# Altium schematic sheet ESC.SchDoc
size A
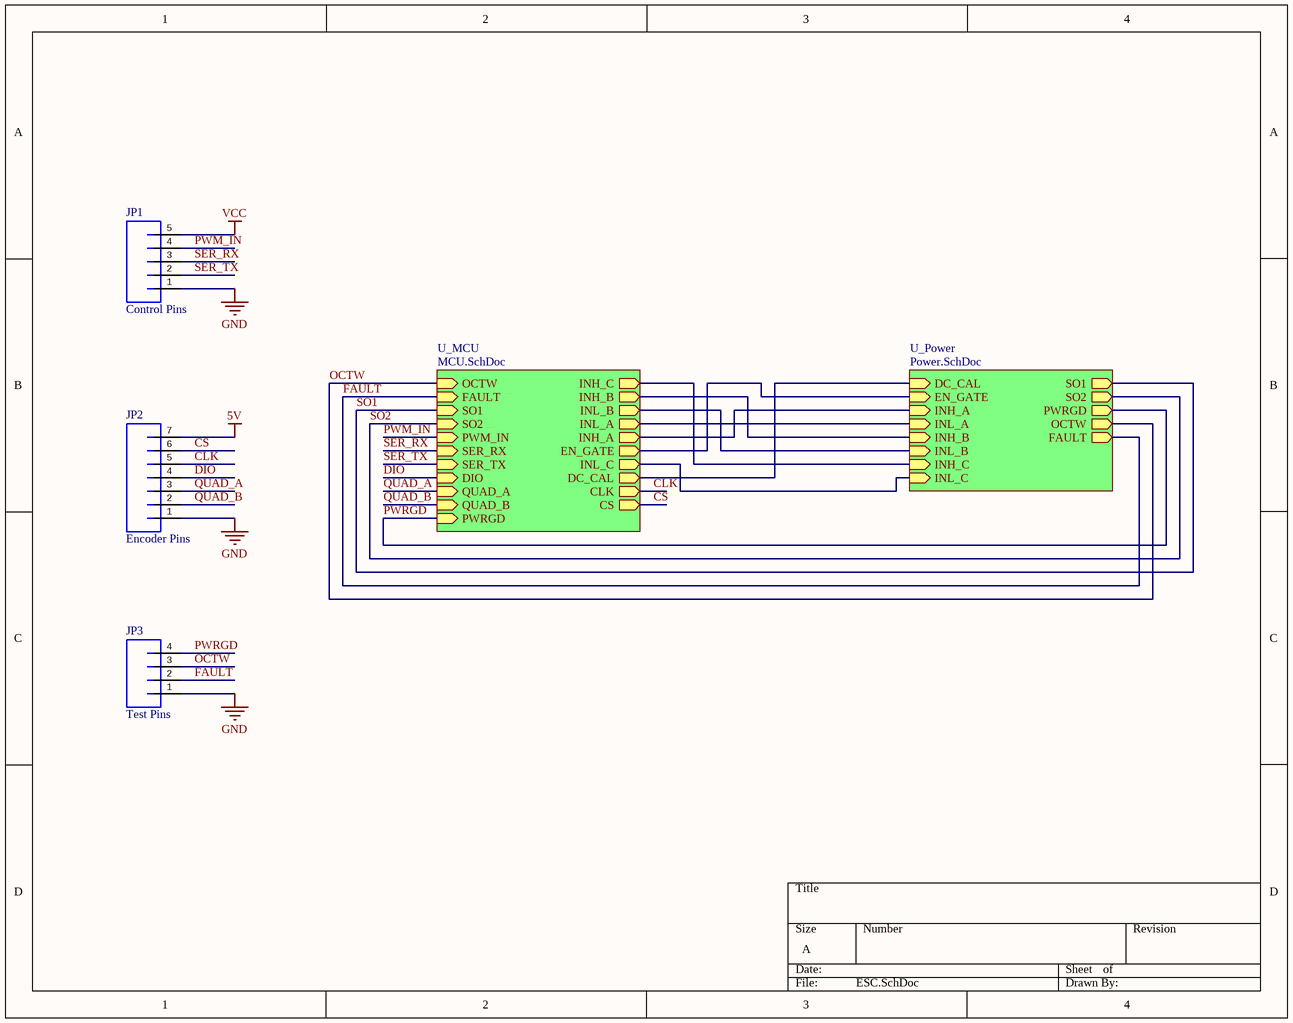
[diagram p0: ESC.SchDoc]

## Parts
JP1  Control Pins  [JST-5-PTH-VERT]
JP2  Encoder Pins  [JST-7-PTH-VERT]
JP3  Test Pins  [JST-4-PTH-VERT]

## Sub-sheets
U_MCU = MCU.SchDoc: INH_C (out), INH_B (out), INL_B (out), OCTW (in), FAULT (in), INL_A (out), INH_A (out), EN_GATE (out), INL_C (out), DC_CAL (out), SO1 (in), SO2 (in), PWM_IN (in), SER_RX (in), SER_TX (in), DIO (in), CLK (out), CS (out), QUAD_A (in), QUAD_B (in), PWRGD (in)
U_Power = Power.SchDoc: DC_CAL (in), EN_GATE (in), INH_A (in), INL_A (in), INH_B (in), INL_B (in), INH_C (in), INL_C (in), SO1 (out), SO2 (out), PWRGD (out), OCTW (out), FAULT (out)

## Nets
5V: JP2.7
GND: JP1.1 JP2.1 JP3.1
VCC: JP1.5
CLK: JP2.5 ; sheet U_MCU/CLK
CS: JP2.6 ; sheet U_MCU/CS
DIO: JP2.4 ; sheet U_MCU/DIO
FAULT: JP3.2 ; sheet U_Power/FAULT, sheet U_MCU/FAULT
OCTW: JP3.3 ; sheet U_Power/OCTW, sheet U_MCU/OCTW
PWM_IN: JP1.4 ; sheet U_MCU/PWM_IN
PWRGD: JP3.4 ; sheet U_Power/PWRGD, sheet U_MCU/PWRGD
QUAD_A: JP2.3 ; sheet U_MCU/QUAD_A
QUAD_B: JP2.2 ; sheet U_MCU/QUAD_B
SER_RX: JP1.3 ; sheet U_MCU/SER_RX
SER_TX: JP1.2 ; sheet U_MCU/SER_TX
SO1: sheet U_Power/SO1, sheet U_MCU/SO1
SO2: sheet U_Power/SO2, sheet U_MCU/SO2
(unnamed): sheet U_Power/DC_CAL, sheet U_MCU/DC_CAL
(unnamed): sheet U_Power/EN_GATE, sheet U_MCU/EN_GATE
(unnamed): sheet U_Power/INH_A, sheet U_MCU/INH_A
(unnamed): sheet U_Power/INL_A, sheet U_MCU/INL_A
(unnamed): sheet U_Power/INH_B, sheet U_MCU/INH_B
(unnamed): sheet U_Power/INL_B, sheet U_MCU/INL_B
(unnamed): sheet U_Power/INH_C, sheet U_MCU/INH_C
(unnamed): sheet U_Power/INL_C, sheet U_MCU/INL_C

## Library data of the parts
JP1 = JST_5_VERT
JP2 = JST_7_VERT
JP3 = JST_4_VERT